# EAGLE schematic Tiny84_board (EAGLE 6.4)
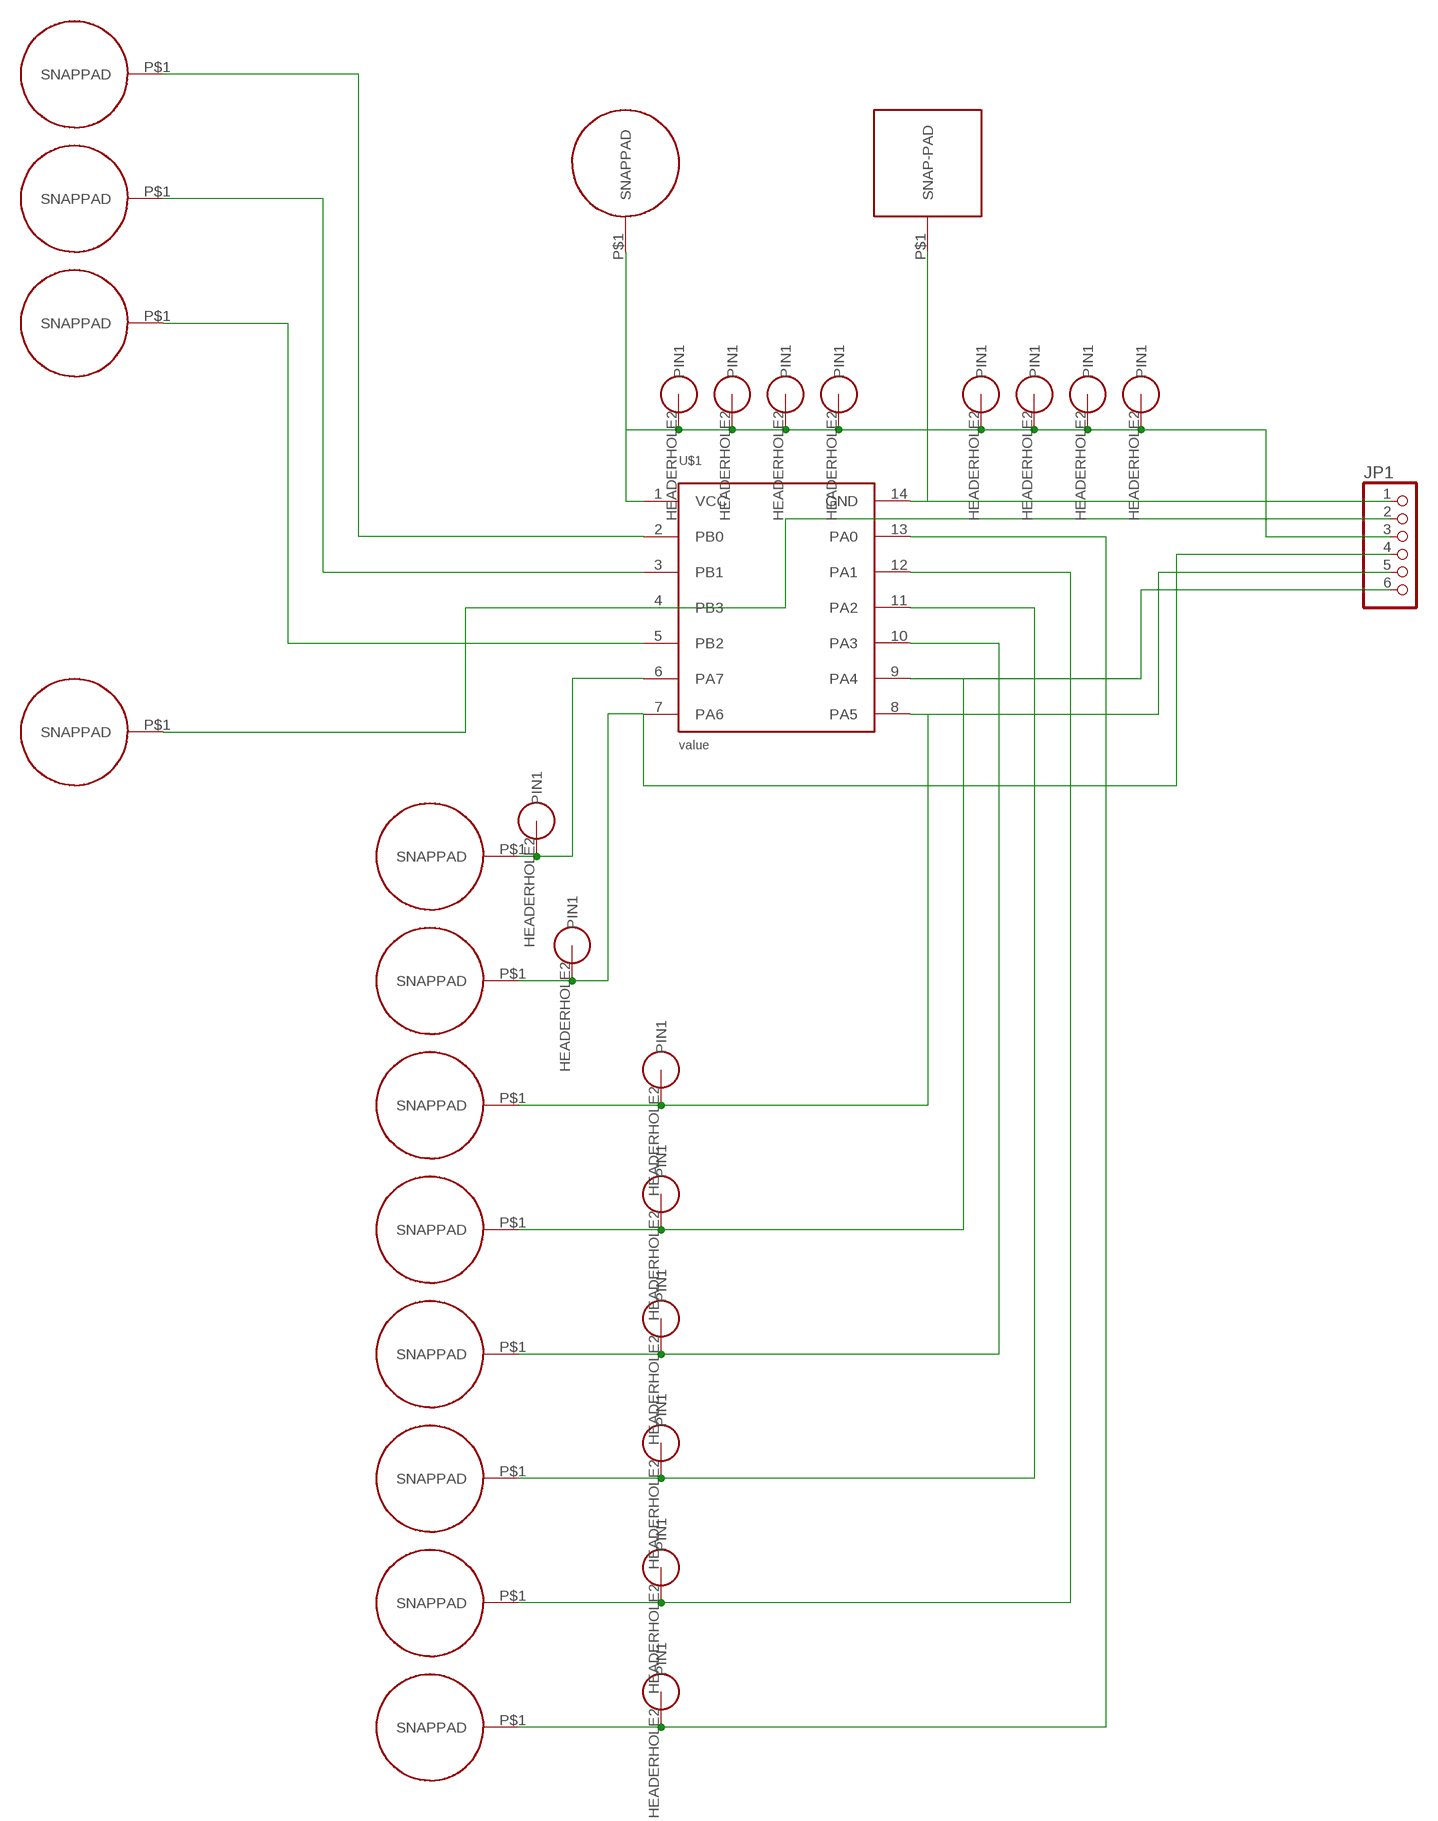
[diagram p0: schematic, sheet 1]

## Parts
JP1  PINHD-1X6/90  [1X06/90]
U$1  ATTINY84  [SOIC14]
U$2  SNAP-PAD_7MM_ROUND  [SNAP-PAD_7MM_RD]
U$3  SNAP-PAD_7MM_ROUND  [SNAP-PAD_7MM_RD]
U$4  SNAP-PAD_7MM_ROUND  [SNAP-PAD_7MM_RD]
U$5  SNAP-PAD_7MM_ROUND  [SNAP-PAD_7MM_RD]
U$6  SNAP-PAD_7MM_ROUND  [SNAP-PAD_7MM_RD]
U$7  SNAP-PAD_7MM_ROUND  [SNAP-PAD_7MM_RD]
U$8  SNAP-PAD_7MM_ROUND  [SNAP-PAD_7MM_RD]
U$9  SNAP-PAD_7MM_ROUND  [SNAP-PAD_7MM_RD]
U$10  SNAP-PAD_7MM_ROUND  [SNAP-PAD_7MM_RD]
U$11  SNAP-PAD_7MM_ROUND  [SNAP-PAD_7MM_RD]
U$12  SNAP-PAD_7MM_ROUND  [SNAP-PAD_7MM_RD]
U$13  SNAP-PAD_7MM_ROUND  [SNAP-PAD_7MM_RD]
U$14  SNAP-PAD_7MM_SQUARE  [SNAP-PAD_7MM_SQ]
U$15  HEADER_1PIN  [HEADER_1PIN]
U$16  HEADER_1PIN  [HEADER_1PIN]
U$17  HEADER_1PIN  [HEADER_1PIN]
U$18  SNAP-PAD_7MM_ROUND  [SNAP-PAD_7MM_RD]
U$19  HEADER_1PIN  [HEADER_1PIN]
U$20  HEADER_1PIN  [HEADER_1PIN]
U$21  HEADER_1PIN  [HEADER_1PIN]
U$22  HEADER_1PIN  [HEADER_1PIN]
U$23  HEADER_1PIN  [HEADER_1PIN]
U$24  HEADER_1PIN  [HEADER_1PIN]
U$25  HEADER_1PIN  [HEADER_1PIN]
U$26  HEADER_1PIN  [HEADER_1PIN]
U$27  HEADER_1PIN  [HEADER_1PIN]
U$28  HEADER_1PIN  [HEADER_1PIN]
U$29  HEADER_1PIN  [HEADER_1PIN]
U$30  HEADER_1PIN  [HEADER_1PIN]
U$31  HEADER_1PIN  [HEADER_1PIN]

## Nets
N$2: JP1.1 U$1.14(GND) U$14.P$1(SNAP-PAD)
N$3: U$1.6(PA7) U$2.P$1(SNAPPAD) U$27.HEADERHOLE2(PIN1)
N$4: JP1.4 U$1.7(PA6) U$3.P$1(SNAPPAD) U$26.HEADERHOLE2(PIN1)
N$5: JP1.5 U$1.8(PA5) U$4.P$1(SNAPPAD) U$17.HEADERHOLE2(PIN1)
N$6: JP1.6 U$1.9(PA4) U$5.P$1(SNAPPAD) U$19.HEADERHOLE2(PIN1)
N$7: U$1.10(PA3) U$6.P$1(SNAPPAD) U$20.HEADERHOLE2(PIN1)
N$8: U$1.11(PA2) U$7.P$1(SNAPPAD) U$21.HEADERHOLE2(PIN1)
N$9: U$1.12(PA1) U$8.P$1(SNAPPAD) U$22.HEADERHOLE2(PIN1)
N$10: U$1.13(PA0) U$9.P$1(SNAPPAD) U$23.HEADERHOLE2(PIN1)
N$11: U$1.5(PB2) U$13.P$1(SNAPPAD)
N$12: U$1.3(PB1) U$12.P$1(SNAPPAD)
N$13: U$1.2(PB0) U$11.P$1(SNAPPAD)
N$14: JP1.2 U$1.4(PB3) U$18.P$1(SNAPPAD)
VCC: JP1.3 U$1.1(VCC) U$10.P$1(SNAPPAD) U$15.HEADERHOLE2(PIN1) U$16.HEADERHOLE2(PIN1) U$24.HEADERHOLE2(PIN1) U$25.HEADERHOLE2(PIN1) U$28.HEADERHOLE2(PIN1) U$29.HEADERHOLE2(PIN1) U$30.HEADERHOLE2(PIN1) U$31.HEADERHOLE2(PIN1)

## Library data of the parts
JP1 = pinhead:PINHD-1X6: PIN HEADER
U$1 = hannahsEagleLib:ATTINY84
U$2-U$13 U$18 = hannahsEagleLib:SNAP-PAD_7MM_ROUND
U$14 = hannahsEagleLib:SNAP-PAD_7MM_SQUARE
U$15-U$17 U$19-U$31 = hannahsEagleLib:HEADER_1PIN